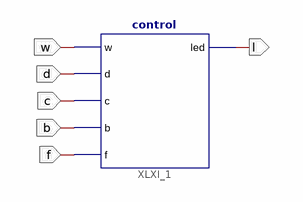
[diagram p0: schematic sheet 1]
// Xilinx ISE schematic top.sch (spartan6) as structural Verilog: 1 symbols, 6 ports
module top (
  input  w,
  input  d,
  input  c,
  input  b,
  input  f,
  output l
);

  control XLXI_1 (.w(w), .d(d), .c(c), .b(b), .f(f), .led(l));
endmodule
